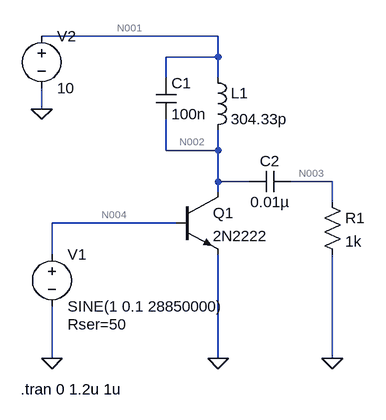
[diagram p0: schematic Class_C_Amplifier_Demo.asc]
Class_C_Amplifier_Demo.asc, the LTspice schematic file:
Version 4.1
SHEET 1 1956 988
WIRE 288 -32 16 -32
WIRE 288 0 288 -32
WIRE 288 0 208 0
WIRE 208 32 208 0
WIRE 288 32 288 0
WIRE 16 80 16 48
WIRE 208 144 208 96
WIRE 288 144 288 112
WIRE 288 144 208 144
WIRE 288 192 288 144
WIRE 336 192 288 192
WIRE 464 192 400 192
WIRE 288 208 288 192
WIRE 464 224 464 192
WIRE 224 256 32 256
WIRE 32 304 32 256
WIRE 32 464 32 384
WIRE 288 464 288 304
WIRE 464 464 464 304
FLAG 16 80 0
FLAG 288 464 0
FLAG 32 464 0
FLAG 464 464 0
SYMBOL cap 192 32 R0
SYMATTR InstName C1
SYMATTR Value 100n
SYMBOL ind 272 16 R0
SYMATTR InstName L1
SYMATTR Value 304.33p
SYMBOL npn 224 208 R0
SYMATTR InstName Q1
SYMATTR Value 2N2222
SYMBOL voltage 32 288 R0
WINDOW 123 0 0 Left 0
WINDOW 39 24 124 Left 2
SYMATTR SpiceLine Rser=50
SYMATTR InstName V1
SYMATTR Value SINE(1 0.1 28850000)
SYMBOL voltage 16 -48 R0
SYMATTR InstName V2
SYMATTR Value 10
SYMBOL cap 400 176 R90
WINDOW 0 0 32 VBottom 2
WINDOW 3 32 32 VTop 2
SYMATTR InstName C2
SYMATTR Value 0.01µ
SYMBOL res 448 208 R0
SYMATTR InstName R1
SYMATTR Value 1k
TEXT -16 512 Left 2 !.tran 0 1.2u 1u

The netlist it stands for:
* Class_C_Amplifier_Demo.asc
C1 N001 N002 100n
L1 N001 N002 304.33p
Q1 N002 N004 0 0 2N2222
V1 N004 0 SINE(1 0.1 28850000) Rser=50
V2 N001 0 10
C2 N003 N002 0.01µ
R1 N003 0 1k
.model NPN NPN
.model PNP PNP
.lib standard.bjt
.tran 0 1.2u 1u
.backanno
.end

* Results of the author's LTspice run, read from the files saved beside the schematic
* Operating Point, zero values left out:
*   V(n001) = 10 V
*   V(n002) = 10 V
*   V(n004) = 888.9 mV
*   I(L1) = 266.9 mA
*   I(V1) = -2.223 mA
*   I(V2) = -266.9 mA
*   Ib(Q1) = 2.223 mA
*   Ic(Q1) = 266.9 mA
*   Ie(Q1) = -269.2 mA
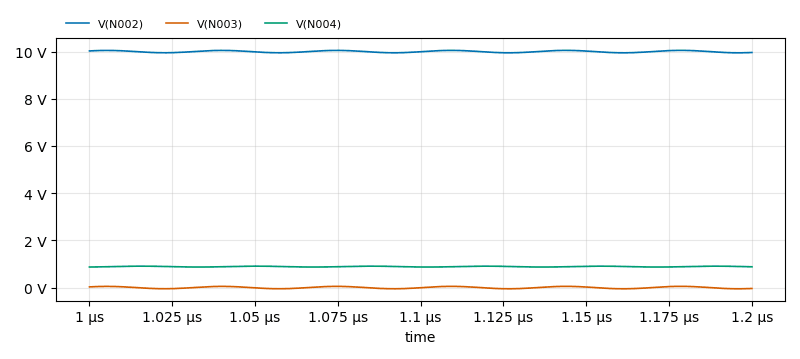
[diagram p1: Transient Analysis of Class_C_Amplifier_Demo.asc, plotted from the saved traces]
* Transient Analysis, 1 run:
*   V(N002): min 9.948 V, max 10.05 V, average 10 V, rms 10 V, last 9.961 V
*   V(N003): min -52.19 mV, max 51.96 mV, average 126.6 µV, rms 36.41 mV, last -38.27 mV
*   V(N004): min 869.8 mV, max 907.9 mV, average 889.4 mV, rms 889.5 mV, last 880.5 mV